# EAGLE schematic phase90 (EAGLE 8.2.0)
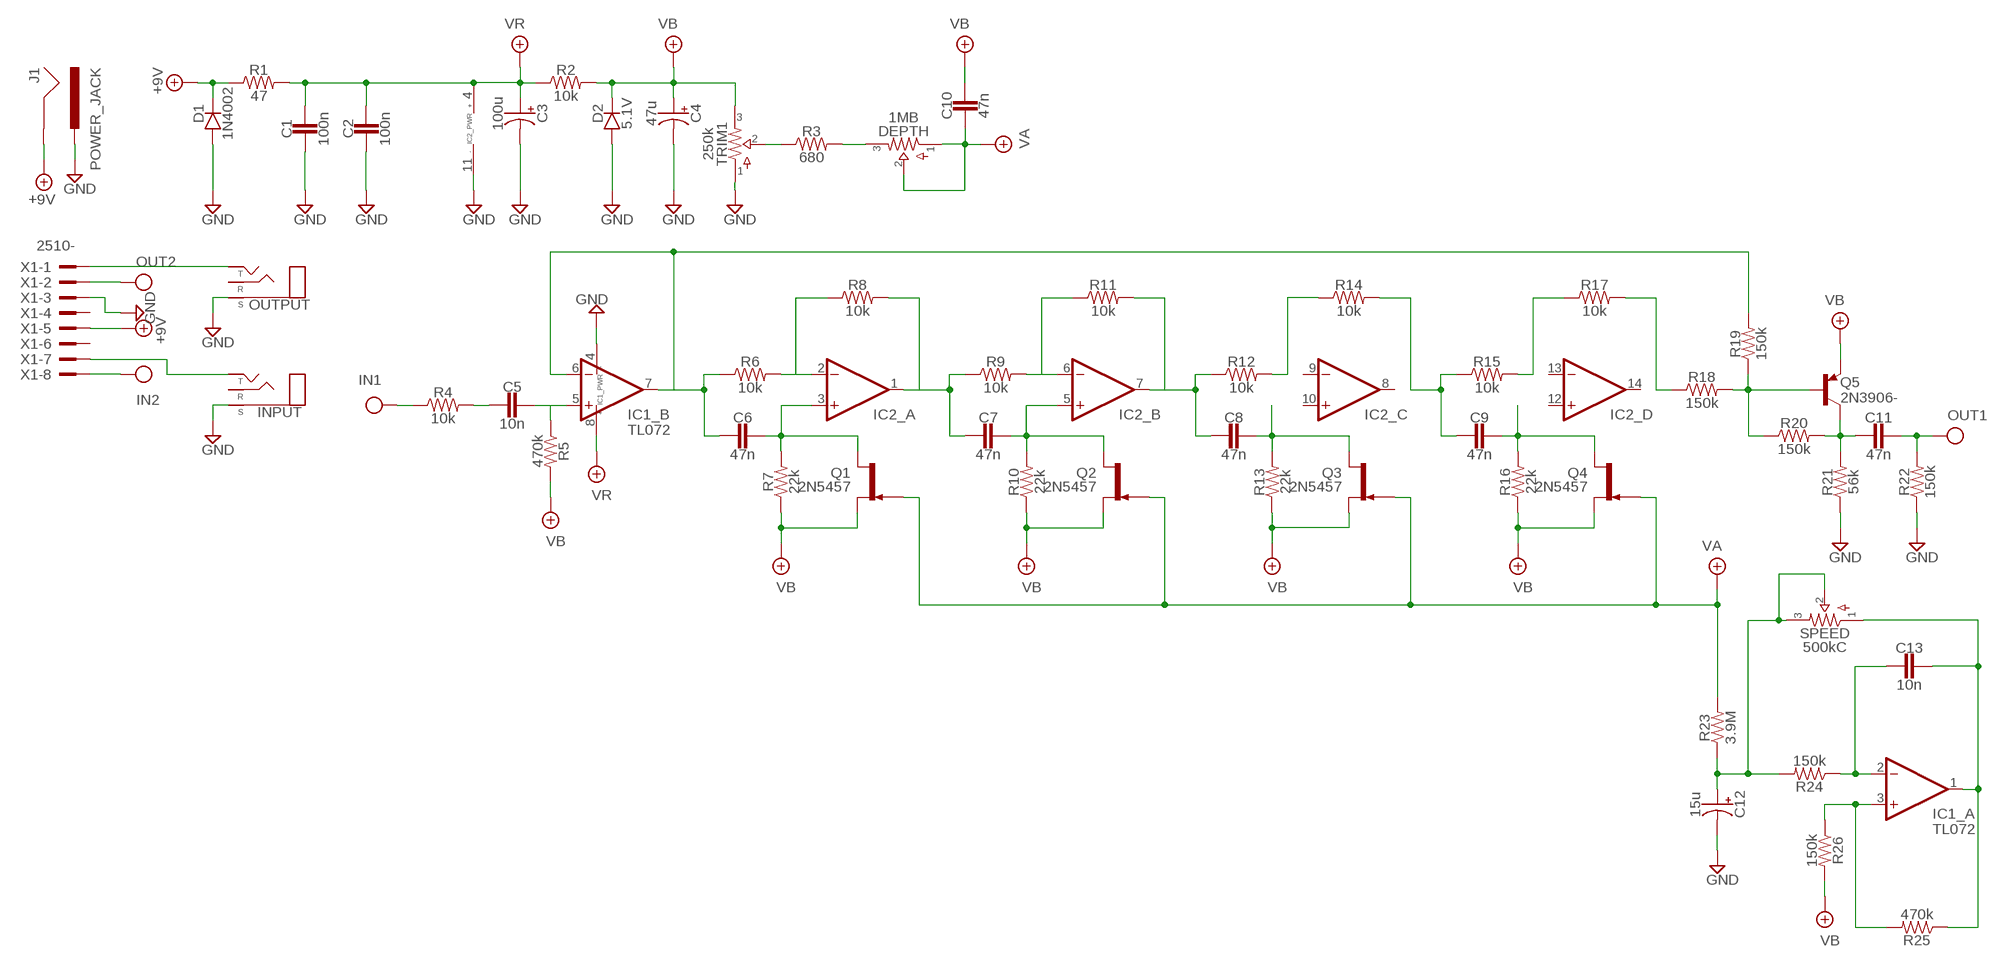
[diagram p0: schematic, sheet 1]

## Parts
C1  100n  CER/FILM2  [050X030_025_2]
C2  100n  CER/FILM2  [050X030_025_2]
C3  100u  0500  [050_020]
C4  47u  0500  [050_020]
C5  10n  CER/FILMBOX.1  [BOX_SMALL]
C6  47n  CER/FILMBOX.1  [BOX_SMALL]
C7  47n  CER/FILMBOX.1  [BOX_SMALL]
C8  47n  CER/FILMBOX.1  [BOX_SMALL]
C9  47n  CER/FILMBOX.1  [BOX_SMALL]
C10  47n  CER/FILMBOX.1  [BOX_SMALL]
C11  47n  CER/FILMBOX.1  [BOX_SMALL]
C12  15u  0501  [050_020_1]
C13  10n  CER/FILMBOX.1  [BOX_SMALL]
D1  1N4002  DO41.2  [DO41-2]
D2  5.1V  DO41.2  [DO41-2]
DEPTH  1MB  POTS16MM  [16MM]
IC1  TL072  DUALTH  [DIL0]
IC2  QUADTH  [DIL14]
INPUT  STEREONMJ  [NMJ6HCD2]
J1  POWER_JACK  [POWER_JACK_PTH]
OUTPUT  STEREONMJ  [NMJ6HCD2]
Q1  2N5457  [TO92-]
Q2  2N5457  [TO92-]
Q3  2N5457  [TO92-]
Q4  2N5457  [TO92-]
Q5  2N3906-  [TO92-]
R1  47  R_.3B  [R0207/3]
R2  10k  R_.3B  [R0207/3]
R3  680  R_.3B  [R0207/3]
R4  10k  R_.3B  [R0207/3]
R5  470k  R_.3B  [R0207/3]
R6  10k  R_.3B  [R0207/3]
R7  22k  R_.3B  [R0207/3]
R8  10k  R_.3B  [R0207/3]
R9  10k  R_.3B  [R0207/3]
R10  22k  R_.3B  [R0207/3]
R11  10k  R_.3B  [R0207/3]
R12  10k  R_.3B  [R0207/3]
R13  22k  R_.3B  [R0207/3]
R14  10k  R_.3B  [R0207/3]
R15  10k  R_.3B  [R0207/3]
R16  22k  R_.3B  [R0207/3]
R17  10k  R_.3B  [R0207/3]
R18  150k  R_.3B  [R0207/3]
R19  150k  R_.3B  [R0207/3]
R20  150k  R_.3B  [R0207/3]
R21  56k  R_.3B  [R0207/3]
R22  150k  R_.3B  [R0207/3]
R23  3.9M  R_.3B  [R0207/3]
R24  150k  R_.3B  [R0207/3]
R25  470k  R_.3B  [R0207/3]
R26  150k  R_.3B  [R0207/3]
SPEED  500kC  POTS16MM  [16MM]
TRIM1  250k  POTSTEST  [RTRIM3296W]
X1  2510-  [PAK100/2500-10]

## Nets
+9V: D1.C J1.GND R1.1 X1.5
GND: C1.2 C2.2 C3.- C4.- C12.- D1.A D2.A IC1.4(_PWR:V-) IC2.11(_PWR:V-) INPUT.S J1.PWR OUTPUT.S R21.1 R22.1 TRIM1.1 X1.3
IN: R4.1 X1.8
N$1: R3.1 TRIM1.2
N$2: INPUT.T X1.7
N$3: DEPTH.3 R3.2
N$4: OUTPUT.T X1.1
N$5: C5.2 R4.2
N$6: C6.2 IC1.6(_B:-IN) IC1.7(_B:OUT) R6.1 R19.2
N$7: IC2.2(_A:-IN) R6.2 R8.1
N$8: C5.1 IC1.5(_B:+IN) R5.1
N$9: C6.1 IC2.3(_A:+IN) Q1.3(D) R7.2
N$10: C7.2 IC2.1(_A:OUT) R8.2 R9.1
N$12: IC2.6(_B:-IN) R9.2 R11.1
N$13: C7.1 IC2.5(_B:+IN) Q2.3(D) R10.2
N$14: C8.2 IC2.7(_B:OUT) R11.2 R12.1
N$15: IC1.3(_A:+IN) R25.2 R26.1
N$16: R12.2 R14.1
N$17: C8.1 Q3.3(D) R13.2
N$18: C9.2 R14.2 R15.1
N$19: C13.1 IC1.1(_A:OUT) R25.1 SPEED.1
N$20: R15.2 R17.1
N$21: C9.1 Q4.3(D) R16.2
N$22: R17.2 R18.1
N$24: Q5.2(B) R18.2 R19.1 R20.1
N$25: C11.2 Q5.1(C) R20.2 R21.2
N$26: C13.2 IC1.2(_A:-IN) R24.1
N$27: C12.+ R23.1 R24.2 SPEED.2 SPEED.3
OUT: C11.1 R22.2 X1.2
VA: C10.2 DEPTH.1 DEPTH.2 Q1.1(G) Q2.1(G) Q3.1(G) Q4.1(G) R23.2
VB: C4.+ C10.1 D2.C Q1.2(S) Q2.2(S) Q3.2(S) Q4.2(S) Q5.3(E) R2.2 R5.2 R7.1 R10.1 R13.1 R16.1 R26.2 TRIM1.3
VR: C1.1 C2.1 C3.+ IC1.8(_PWR:V+) IC2.4(_PWR:V+) R1.2 R2.1
Unconnected: IC2.8(_C:OUT) IC2.9(_C:-IN) IC2.10(_C:+IN) IC2.12(_D:+IN) IC2.13(_D:-IN) IC2.14(_D:OUT) INPUT.R OUTPUT.R X1.4 X1.6

## Library data of the parts
C1 C2 C5-C11 C13 = pedals-capacitors-film:CER/FILM: 47 - 120pF Xicon Ceramic Disc 2.5mm lead spacing
C3 C4 C12 = pedals-capacitors-elec:050
D1 D2 = pedals-diodes:DO41: DO-41 Package Diodes: 1N4001 - 1N40019 Zener Diodes: 1N4728 - 1N4764
DEPTH SPEED TRIM1 = pedals-potentiometers:POTS
IC1 = pedals-integrated circuits:DUAL: OP AMP
IC2 = pedals-integrated circuits:QUAD: OP AMP
INPUT OUTPUT = pedals-jacks:STEREO
J1 = pedals-jacks:POWER_JACK: Power Jack Connector This is the standard 5.5mm barrel jack for power. The PTH is the most common, proven, reliable, footprint. The Slot footprint only works if the mill layer is transmitted to the PCB fab house so be warned. Here are the connectors we sell at SparkFun: DC Barrel Power Jack/Connector <https://www.sparkfun.com/products/119> (PRT-00119) DC Barrel Power Jack/Connector (SMD) <https://www.sparkfun.com/products/12748> (PRT-12748) DC Barrel Jack Adapter - Breadboard Compatible <https://www.sparkfun.com/products/10811> (PRT-10811) It is used on this SparkFun product (and many, many others): SparkFun RedBoard - Programmed with Arduino <https://www.sparkfun.com/products/12757> (DEV-12757) Also, if you need a mating power supply or connector, please check these out: Wall Adapter Power Supply - 9VDC 650mA <https://www.sparkfun.com/products/298> (TOL-00298) DC Barrel Jack Adapter - Male <https://www.sparkfun.com/products/10287> (PRT-10287); PROD_ID: CONN-08197
Q1-Q4 = pedals-transistors:2N5457: N-CHANNEL JFET
Q5 = pedals-transistors:2N3906: PNP Transistor
R1-R26 = pedals-resistors:R_
X1 = pedals-headers:2510-: 3M (TM) Pak 100 4-Wall Header Source: 3M; MF: 3M; MPN: 2510-6002UB; OC_FARNELL: 9838244; OC_NEWARK: 46F4725